# EAGLE design Illuminator BOOST Extended (EAGLE 9.6.2)
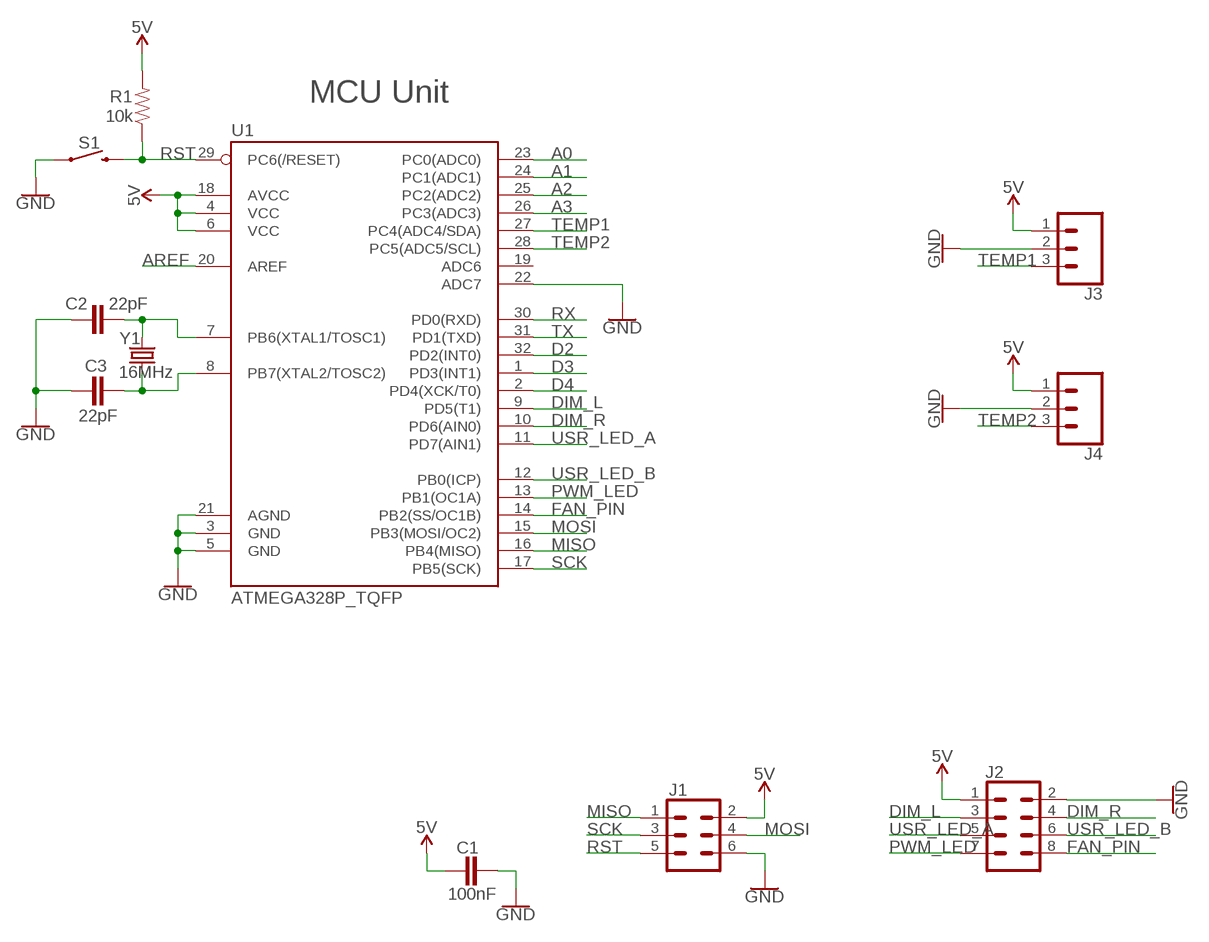
[diagram p0: schematic, sheet 1]

## Parts
C1  100nF  1.0UF-0805-25V-(+80/-20%)  [0805]
C2  22pF  22PF-0603-50V-5%  [0603]
C3  22pF  22PF-0603-50V-5%  [0603]
J1  CONN_03X2NO_SILK  [2X3-NS]
J2  CONN_04X2  [2X4]
J3  CONN_03JST-PTH-VERT  [JST-3-PTH-VERT]
J4  CONN_03JST-PTH-VERT  [JST-3-PTH-VERT]
R1  10k  RESISTOR1206  [1206]
S1  MOMENTARY-SWITCH-SPST-SMD-6.0X3.5MM  [TACTILE_SWITCH_SMD_6.0X3.5MM]
U1  ATMEGA328P_TQFP  [TQFP32-08]
Y1  16MHz  CRYSTAL-16MHZSMD-5X3.2  [CRYSTAL-SMD-5X3.2-4PAD]

## Nets
5V: C1.1 J1.2 J2.1 J3.1 J4.1 R1.2 U1.4(VCC) U1.6(VCC) U1.18(AVCC)
A0: U1.23(PC0(ADC0))
A1: U1.24(PC1(ADC1))
A2: U1.25(PC2(ADC2))
A3: U1.26(PC3(ADC3))
AREF: U1.20(AREF)
D2: U1.32(PD2(INT0))
D3: U1.1(PD3(INT1))
D4: U1.2(PD4(XCK/T0))
DIM_L: J2.3 U1.9(PD5(T1))
DIM_R: J2.4 U1.10(PD6(AIN0))
FAN_PIN: J2.8 U1.14(PB2(SS/OC1B))
GND: C1.2 C2.1 C3.1 J1.6 J2.2 J3.2 J4.2 S1.1 U1.3(GND) U1.5(GND) U1.21(AGND) U1.22(ADC7)
MISO: J1.1 U1.16(PB4(MISO))
MOSI: J1.4 U1.15(PB3(MOSI/OC2))
N$9: C3.2 U1.8(PB7(XTAL2/TOSC2)) Y1.1
N$19: C2.2 U1.7(PB6(XTAL1/TOSC1)) Y1.3
PWM_LED: J2.7 U1.13(PB1(OC1A))
RST: J1.5 R1.1 S1.2 U1.29(PC6(/RESET))
RX: U1.30(PD0(RXD))
SCK: J1.3 U1.17(PB5(SCK))
TEMP1: J3.3 U1.27(PC4(ADC4/SDA))
TEMP2: J4.3 U1.28(PC5(ADC5/SCL))
TX: U1.31(PD1(TXD))
USR_LED_A: J2.5 U1.11(PD7(AIN1))
USR_LED_B: J2.6 U1.12(PB0(ICP))
Unconnected: U1.19(ADC6)

## Notes on the sheet
- MCU Unit

## Library data of the parts
C1 = SparkFun-Capacitors:1.0UF: 1µF ceramic capacitors A capacitor is a passive two-terminal electrical component used to store electrical energy temporarily in an electric field.; PROD_ID: CAP-11625; VALUE: 1.0uF
C2 C3 = SparkFun-Capacitors:22PF: 22pF ceramic capacitors A capacitor is a passive two-terminal electrical component used to store electrical energy temporarily in an electric field.; PROD_ID: CAP-07876
J1 = SparkFun-Connectors:CONN_03X2: Multi connection point. Often used as Generic Header-pin footprint for 0.1 inch spaced/style header connections You can populate with any combo of single row headers, but if you'd like an exact match, check these: Header - 2x3 (Male, 0.1") <https://www.sparkfun.com/products/12807> (PRT-12807) Header - 2x3 (Female, 0.1") <https://www.sparkfun.com/products/13010> (PRT-13010) 2x3 Pin Shrouded Header <https://www.sparkfun.com/products/10877> (PRT-10877) On any of the 0.1 inch spaced packages, you can populate with these: Break Away Headers - Straight <https://www.sparkfun.com/products/116> (PRT-00116) Break Away Male Headers - Right Angle <https://www.sparkfun.com/products/553> (PRT-00553) Female Headers <https://www.sparkfun.com/products/115> (PRT-00115) Break Away Headers - Machine Pin <https://www.sparkfun.com/products/117> (PRT-00117) Break Away Female Headers - Swiss Machine Pin <https://www.sparkfun.com/products/743> (PRT-00743) Special note: the shrouded connector mates well with our 3x2 ribbon cables: Ribbon Crimp Connector - 6-pin (2x3, Female) <https://www.sparkfun.com/products/10651> (PRT-10651) Ribbon Cable - 6 wire (15ft) <https://www.sparkfun.com/products/10646> (PRT-10646)
J2 = SparkFun-Connectors:CONN_04X2: Multi connection point. Often used as Generic Header-pin footprint for 0.1 inch spaced/style header connections On any of the 0.1 inch spaced packages, you can populate with these: Break Away Headers - Straight <https://www.sparkfun.com/products/116> (PRT-00116) Break Away Male Headers - Right Angle <https://www.sparkfun.com/products/553> (PRT-00553) Female Headers <https://www.sparkfun.com/products/115> (PRT-00115) Break Away Headers - Machine Pin <https://www.sparkfun.com/products/117> (PRT-00117) Break Away Female Headers - Swiss Machine Pin <https://www.sparkfun.com/products/743> (PRT-00743)
J3 J4 = SparkFun-Connectors:CONN_03: Multi connection point. Often used as Generic Header-pin footprint for 0.1 inch spaced/style header connections On any of the 0.1 inch spaced packages, you can populate with these: Break Away Headers - Straight <https://www.sparkfun.com/products/116> (PRT-00116) Break Away Male Headers - Right Angle <https://www.sparkfun.com/products/553> (PRT-00553) Female Headers <https://www.sparkfun.com/products/115> (PRT-00115) Break Away Headers - Machine Pin <https://www.sparkfun.com/products/117> (PRT-00117) Break Away Female Headers - Swiss Machine Pin <https://www.sparkfun.com/products/743> (PRT-00743) Stackable Header - 3 Pin (Female, 0.1") <https://www.sparkfun.com/products/13875> (PRT-13875) For SCREWTERMINALS and SPRING TERMINALS visit here: Screw Terimnals on SparkFun.com <https://www.sparkfun.com/search/results?term=Screw+Terminals> (5mm/3.5mm/2.54mm spacing) This device is also useful as a general connection point to wire up your design to another part of your project. Our various solder wires solder well into these plated through hole pads. Hook-Up Wire - Assortment (Stranded, 22 AWG) <https://www.sparkfun.com/products/11375> (PRT-11375) Hook-Up Wire - Assortment (Solid Core, 22 AWG) <https://www.sparkfun.com/products/11367> (PRT-11367) View the entire wire category on our website here <https://www.sparkfun.com/categories/141> Special notes: Molex polarized connector foot print use with SKU : PRT-08232 with associated crimp pins and housings.; PROD_ID: CONN-13230
R1 = SparkFun-Resistors:RESISTOR: Generic Resistor Package
S1 = SparkFun-Switches:MOMENTARY-SWITCH-SPST: Momentary Switch (Pushbutton) - SPST Normally-open (NO) SPST momentary switches (buttons, pushbuttons). Variants PTH-12MM - 12mm square, through-hole Momentary Pushbutton Switch - 12mm Square <https://www.sparkfun.com/products/9190> (COM-09190) PTH-6.0MM, PTH-6.0MM-KIT - 6.0mm square, through-hole Mini Pushbutton Switch <https://www.sparkfun.com/products/97> (COM-00097) KIT package intended for soldering kit's - only one side of pads' copper is exposed. PTH-RIGHT-ANGLE-KIT - Right-angle, through-hole Right Angle Tactile Button <https://www.sparkfun.com/products/10791> - Used on SparkFun BigTime Watch Kit <https://www.sparkfun.com/products/11734> SMD-12MM - 12mm square, surface-mount Tactile Button - SMD (12mm) <https://www.sparkfun.com/products/12993> (COM-12993) Used on SparkFun PicoBoard <https://www.sparkfun.com/products/11888> SMD-4.5MM - 4.5mm Square Trackball Switch Used on SparkFun Blackberry Trackballer Breakout <https://www.sparkfun.com/products/13169> SMD-4.6MMX2.8MM - 4.60mm x 2.80mm, surface mount Used on SparkFun SAMD21 Mini Breakout <https://www.sparkfun.com/products/13664> SMD-5.2MM, SMD-5.2-REDUNDANT - 5.2mm square, surface-mount Mini Pushbutton Switch - SMD <https://www.sparkfun.com/products/8720> (COM-08720) Used on Arduino Pro Mini <https://www.sparkfun.com/products/11114> REDUNDANT package connects both switch circuits together SMD-6.0X3.5MM - 6.0 x 3.5mm, surface mount Momentary Reset Switch SMD <https://www.sparkfun.com/products/8229> (COM-08229) SMD-6.2MM-TALL - 6.2mm square, surface mount Tactile Button - SMD (6mm) <https://www.sparkfun.com/products/12992> Used on SparkFun Digital Sandbox <https://www.sparkfun.com/products/12651> SMD-RIGHT-ANGLE - Right-angle, surface mount Used on SparkFun Block for Intel® Edison - Arduino <https://www.sparkfun.com/products/13036>; PROD_ID: SWCH-00815; SF_SKU: COM-08229
U1 = SparkFun-IC-Microcontroller:ATMEGA328P_TQFP: Popular 328P in QFP Storefront component: ATmega328 - TQFP <https://www.sparkfun.com/products/13448> (COM-13448) Datasheet <http://www.sparkfun.com/datasheets/Components/SMD/ATMega328.pdf> SparkFun Products SparkFun RedBoard - Programmed with Arduino <https://www.sparkfun.com/products/12757> (DEV-12757) Arduino Pro Mini 328 - 5V/16MHz <https://www.sparkfun.com/products/11113> (DEV-11113) Arduino Pro Mini 328 - 3.3V/8MHz <https://www.sparkfun.com/products/11114> (DEV-11114) SparkFun OpenLog <https://www.sparkfun.com/products/13712> (DEV-13712) SparkFun MicroView - OLED Arduino Module <https://www.sparkfun.com/products/12923> (DEV-12923) SparkFun Digital Sandbox <https://www.sparkfun.com/products/12651> (DEV-12651) SparkFun PicoBoard <https://www.sparkfun.com/products/11888> (WIG-11888) Arduino Fio <https://www.sparkfun.com/products/10116> (DEV-10116) LilyPad Arduino 328 Main Board <https://www.sparkfun.com/products/13342> (DEV-13342) SparkFun RedStick <https://www.sparkfun.com/products/13741> (DEV-13741) LilyPad MP3 <https://www.sparkfun.com/products/11013> (DEV-11013) LilyPad Arduino SimpleSnap <https://www.sparkfun.com/products/10941> (DEV-10941) SparkFun Stepoko <https://www.sparkfun.com/products/13899> (ROB-13899) SparkFun Geiger Counter <https://www.sparkfun.com/products/11345> (SEN-11345) SparkFun EL Sequencer <https://www.sparkfun.com/products/12781> (COM-12781) Arduino Pro 328 - 5V/16MHz <https://www.sparkfun.com/products/10915> (DEV-10915) CryptoCape <https://www.sparkfun.com/products/12773> (DEV-12773) SparkFun IR Thermometer Evaluation Board - MLX90614 <https://www.sparkfun.com/products/10740> (SEN-10740) SparkFun RedBot Mainboard <https://www.sparkfun.com/products/12097> (ROB-12097) Arduino Pro 328 - 3.3V/8MHz <https://www.sparkfun.com/products/10914> (DEV-10914) SparkFun Block for Intel® Edison - Arduino <https://www.sparkfun.com/products/13036> (DEV-13036) SparkFun Simon Says - Surface Mount Soldering Kit <https://www.sparkfun.com/products/10935> (KIT-10935) SparkFun 7-Segment Serial Display - Red <https://www.sparkfun.com/products/11441> (COM-11441) SparkFun 7-Segment Serial Display - White <https://www.sparkfun.com/products/11629> (COM-11629) SparkFun 7-Segment Serial Display - Yellow <https://www.sparkfun.com/products/11443> (COM-11443) SparkFun 7-Segment Serial Display - Kelly Green <https://www.sparkfun.com/products/11440> (COM-11440) SparkFun 7-Segment Serial Display - Blue <https://www.sparkfun.com/products/11442> (COM-11442) SparkFun OpenSegment Serial Display - 20mm (Blue) <https://www.sparkfun.com/products/11647> (COM-11647) SparkFun OpenSegment Serial Display - 20mm (Green) <https://www.sparkfun.com/products/11646> (COM-11646) SparkFun OpenSegment Serial Display - 20mm (White) <https://www.sparkfun.com/products/11648> (COM-11648) SparkFun OpenSegment Serial Display - 20mm (Red) <https://www.sparkfun.com/products/11644> (COM-11644) SparkFun OpenSegment Serial Display - 20mm (Yellow) <https://www.sparkfun.com/products/11645> (COM-11645) SparkFun OpenSegment Shield <https://www.sparkfun.com/products/13190> (DEV-13190); PROD_ID: IC-09069
Y1 = SparkFun-Clocks:CRYSTAL-16MHZ: 16MHz Crystal Digikey Example <http://www.digikey.com/product-search/en?keywords=535-9122-1-ND> Frequency: 16MHz Frequency Stability: ±50ppm Frequency Tolerance: ±20ppm Load Capacitance: 18pF SparkFun Products: Pro Micro -5V/16MHz <https://www.sparkfun.com/products/12640> SparkFun Serial Enabled LCD Kit <https://www.sparkfun.com/products/10097>; PROD_ID: XTAL-08218; SF_ID: COM-00094

## Board
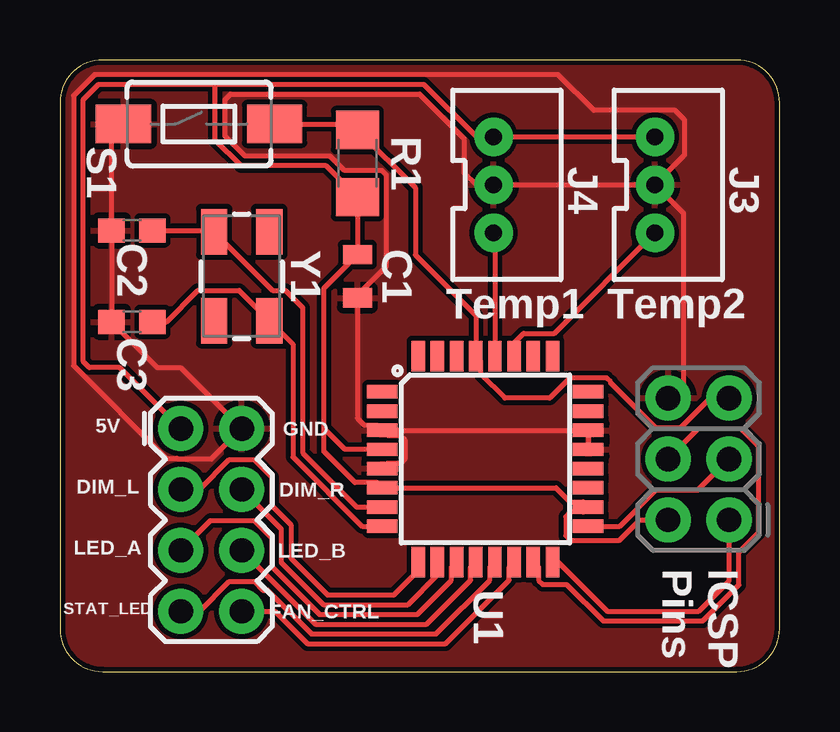
[diagram p1: board, top side]
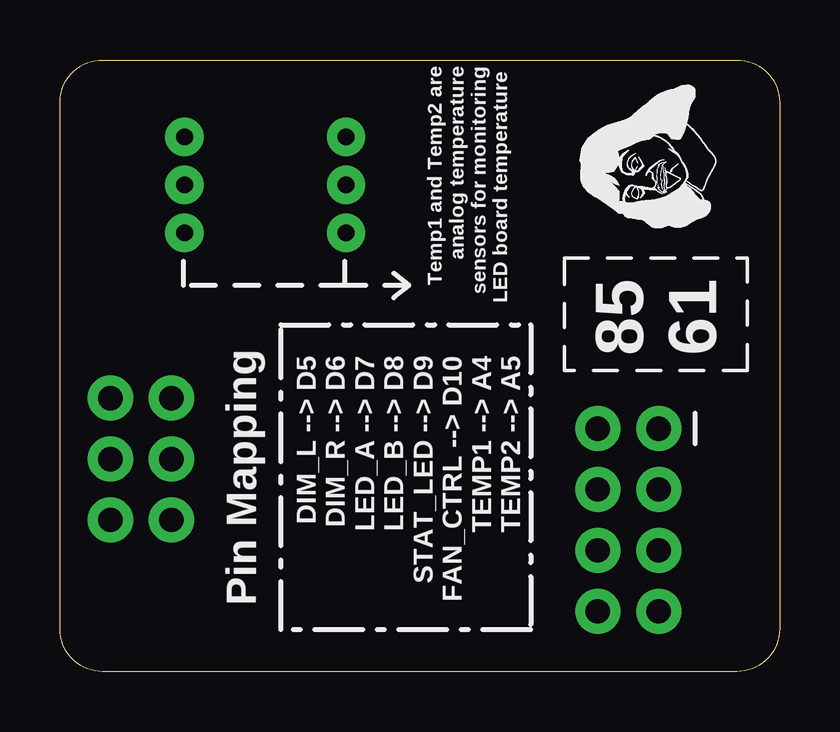
[diagram p2: board, bottom side, seen from below]

Size 30 x 25.5 mm. Coordinates in mm from the lower left corner, seen from the top.
Outline: 1.78,0 28.22,0 arc90 30,1.78 30,23.72 arc90 28.22,25.5 1.78,25.5 arc90 0,23.72 0,1.78 arc90 1.78,0
Copper layers (1*16): Top 0.035mm / dielectric 1.5mm / Bottom 0.035mm
Design rules "SparkFun": minimum track width 8mil, minimum drill 20mil, track to track 8mil, track to pad 8mil, pad to pad 8mil, via to via 8mil, smd to smd 8mil, copper to edge 8mil, drill to drill 8mil, minimum pad ring 12mil, minimum via ring 10mil, stop-mask expansion 4mil, vias tented up to drill 20mil, thermal gap 10mil

### Footprints (pad centres in the part's own frame; a part is rotated, then mirrored left to right if it is on the bottom)
0805 = smd 0.8 x 1.2: 1 -0.9,0; 2 0.9,0
0603 = smd 1.1 x 1: 1 -0.85,0; 2 0.85,0
2X3-NS = drill 1.016 pad 1.88: 1 -2.54,-1.27; 2 -2.54,1.27; 3 0,-1.27; 4 0,1.27; 5 2.54,-1.27; 6 2.54,1.27
2X4 = drill 1.016 pad 1.88: 1 -3.81,-1.27; 2 -3.81,1.27; 3 -1.27,-1.27; 4 -1.27,1.27; 5 1.27,-1.27; 6 1.27,1.27; 7 3.81,-1.27; 8 3.81,1.27
JST-3-PTH-VERT = drill 0.7 pad 1.6: 1 -2,-0.55; 2 0,-0.55; 3 2,-0.55
1206 = smd 1.6 x 1.8: 1 -1.4,0; 2 1.4,0
TACTILE_SWITCH_SMD_6.0X3.5MM = smd 2.3 x 1.6: 1 -3.15,0; 2 3.15,0
TQFP32-08 = smd 1.27 x 0.559: 1 -4.293,2.8; 2 -4.293,2; 3 -4.293,1.2; 4 -4.293,0.4; 5 -4.293,-0.4; 6 -4.293,-1.2; 7 -4.293,-2; 8 -4.293,-2.8; 17 4.293,-2.8; 18 4.293,-2; 19 4.293,-1.2; 20 4.293,-0.4; 21 4.293,0.4; 22 4.293,1.2; 23 4.293,2; 24 4.293,2.8 | smd 0.559 x 1.27: 9 -2.8,-4.293; 10 -2,-4.293; 11 -1.2,-4.293; 12 -0.4,-4.293; 13 0.4,-4.293; 14 1.2,-4.293; 15 2,-4.293; 16 2.8,-4.293; 25 2.8,4.293; 26 2,4.293; 27 1.2,4.293; 28 0.4,4.293; 29 -0.4,4.293; 30 -1.2,4.293; 31 -2,4.293; 32 -2.8,4.293
CRYSTAL-SMD-5X3.2-4PAD = smd 1.9 x 1.1: 1 -1.85,-1.15; 2 1.85,-1.15; 3 1.85,1.15; 4 -1.85,1.15

### Placement (x,y rotation side)
C1  12.4,16.48 270 top
C2  3,18.39 0 top
C3  3,14.58 0 top
J1  26.63,8.86 90 top
J2  6.31,6.32 270 top
J3  25.36,20.29 270 top
J4  18.62,20.29 270 top
R1  12.4,21.18 270 top
S1  5.8,22.83 0 top
U1  17.74,8.86 0 top
Y1  7.58,16.48 90 top

### Tracks (layer width: path | path; a pad name or v marks a point on that pad's centre or on a via)
5V
  Top 0.203: J3.1 J4.1 17.36,22.29 15.16,24.48 6.48,24.48 | J1.2 24.17,6.32 23.33,5.48 21.27,5.48 21.09,5.66 21.09,6.47 21.27,6.65 21.81,6.65 U1.18 21.81,7.08 21.27,7.08 20.68,7.66 U1.6 13.23,7.88 12.3,7.88 11,9.17 11,10.13 | 6.48,24.48 6.48,22.16 7.54,21.09 11.09,21.09 R1.2 C1.1 11,15.98 11,10.13 | J2.1 2.5,12.67 1.23,12.67 0.97,12.93 0.97,23.85 1.61,24.48 6.48,24.48 | U1.4 11.88,9.26 11,10.13
DIM_L
  Top 0.203: J2.3 5.82,7.59 7.06,8.84 8.09,8.84 8.82,8.11 8.82,6.92 9.63,6.11 9.63,4.72 11.15,3.2 13.93,3.2 14.94,4.21 U1.9
DIM_R
  Top 0.203: J2.4 9.23,5.94 9.23,4.55 10.99,2.79 14.5,2.79 15.74,4.02 U1.10
FAN_PIN
  Top 0.203: J2.8 8.97,2.51 10.31,1.17 16.08,1.17 18.72,3.81 18.72,4.35 U1.14
GND
  Top 0.203: U1.3 13.66,9.85 14.21,9.85 14.38,9.67 14.38,8.86 14.21,8.68 13.66,8.68 U1.5 | S1.1 2.15,22.34 C2.1 C3.1 4.06,12.67 5.04,12.67 J2.2 6.31,8.86 4.91,8.86 4.88,8.89 4.44,8.89 0.57,12.76 0.57,24.02 1.44,24.89 20.76,24.89 22.25,23.4 25.64,23.4 26.04,23 26.04,21.52 J3.2 | J3.2 J4.2 17.36,20.29 16.85,20.8 16.85,22.23 15,24.08 7.11,24.08 6.88,23.85 6.88,22.33 7.71,21.5 11.26,21.5 11.87,20.89 13.43,20.89 13.61,20.71 13.61,16.9 12.4,15.7 C1.2 12.4,10.56 12.68,10.28 13.23,10.28 U1.3 | U1.3 U1.22 U1.21 | J3.2 25.99,19.11 25.99,12.04 J1.6
  pour Top: -1,27 -1,-1 31,-1 31,27
MISO
  Top 0.203: U1.16 20.76,4.57 22.82,2.51 26.63,2.51 27.9,3.78 J1.1
MOSI
  Top 0.203: U1.15 19.95,4.35 19.95,3.81 20.13,3.63 21.12,3.63 22.65,2.11 26.79,2.11 28.3,3.61 28.3,4.97 29.14,5.81 29.14,9.38 28.41,10.11 26.6,10.11 J1.4
N$9
  Top 0.203: C3.2 4.44,14.58 5.75,15.89 7.47,15.89 Y1.1 9.71,13.65 9.71,8.95 12.59,6.06 U1.8
N$19
  Top 0.203: C2.2 6.37,18.39 Y1.3 8.87,15.89 9.4,15.89 10.12,15.17 10.12,9.12 12.37,6.86 U1.7
PWM_LED
  Top 0.203: J2.7 5.82,2.51 7.06,3.76 8.09,3.76 8.46,3.39 8.66,3.39 10.48,1.57 15.68,1.57 17.92,3.81 17.92,4.35 U1.13
RST
  Top 0.203: S1.2 12.15,22.83 R1.1 14.81,20.17 14.81,17.37 17.34,14.85 U1.29 17.55,12.94 17.55,12.39 18.54,11.4 20.42,11.4 21.27,12.25 22.79,12.25 22.97,12.07 22.97,12.03 24.84,10.16 25.87,10.16 27.12,11.4 J1.5
SCK
  Top 0.203: U1.17 23.34,6.06 24.84,7.57 26.6,7.57 J1.3
TEMP1
  Top 0.203: J3.3 20.61,14.09 19.33,14.09 18.94,13.7 U1.27
TEMP2
  Top 0.203: J4.3 18.14,18.23 U1.28
USR_LED_A
  Top 0.203: J2.5 6.28,6.3 8.09,6.3 8.82,5.57 8.82,4.38 10.82,2.38 14.9,2.38 16.32,3.81 16.32,4.35 U1.11
USR_LED_B
  Top 0.203: U1.12 17.12,4.35 17.12,3.81 15.29,1.98 10.65,1.98 J2.6

### Text on the board
tPlace: Temp1 | Temp2 | 5V | GND | DIM_L | DIM_R | LED_A | LED_B | ICSP / Pins | STAT_LED | FAN_CTRL
bPlace: Temp1 and Temp2 are / analog temperature / sensors for monitoring / LED board temperature | 85 / 61 | DIM_L --> D5 / DIM_R --> D6 / LED_A --> D7 / LED_B --> D8 / STAT_LED --> D9 / FAN_CTRL --> D10 / TEMP1 --> A4 / TEMP2 --> A5 | Pin Mapping